# EAGLE design sonopi-digi (EAGLE 9.3.0)
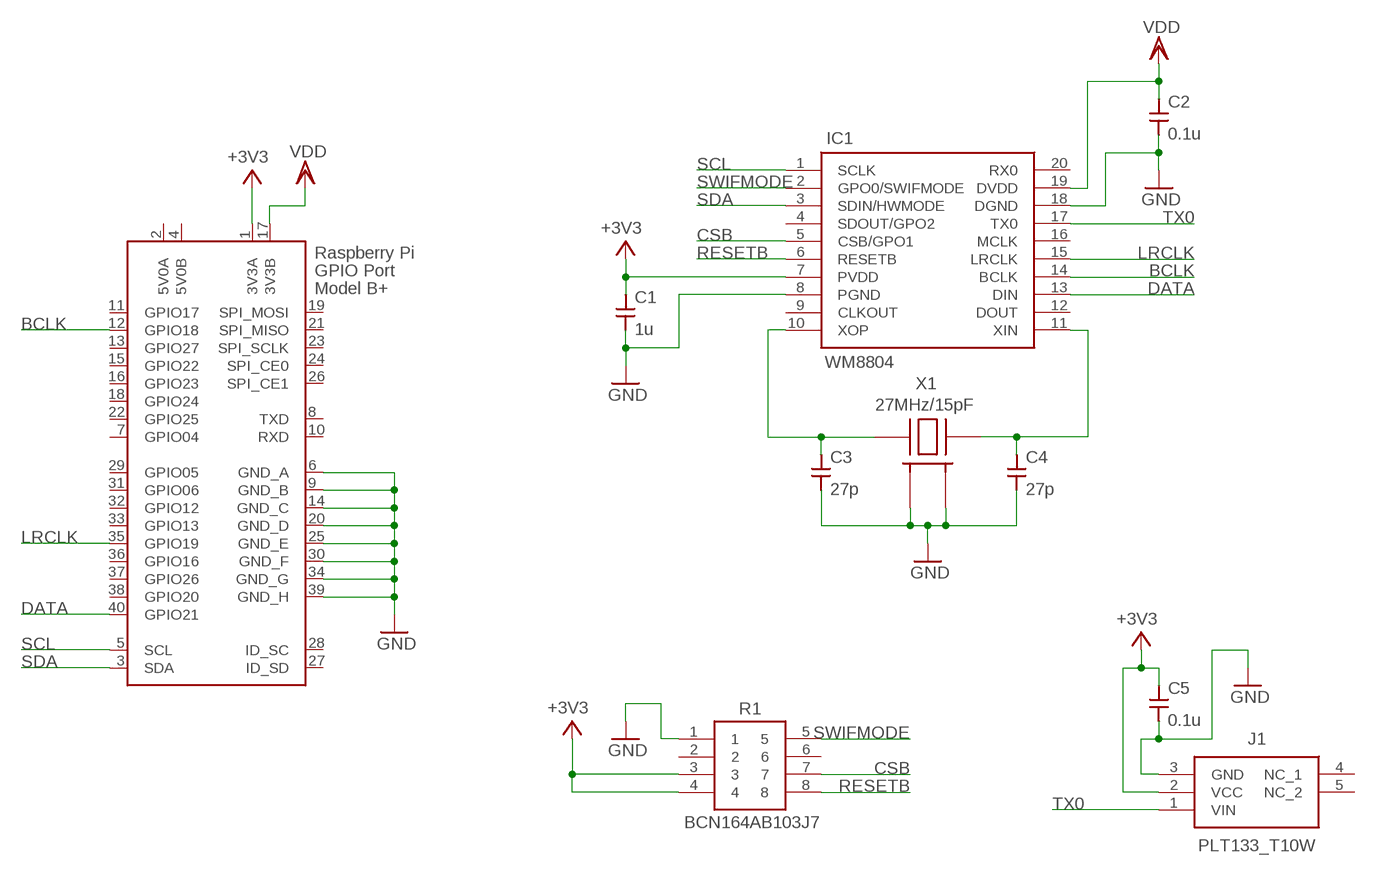
[diagram p0: schematic, sheet 1]

## Parts
C1  1u  CAPACITOR1608  [SMD1608]
C2  0.1u  CAPACITOR1608  [SMD1608]
C3  27p  CAPACITOR1608  [SMD1608]
C4  27p  CAPACITOR1608  [SMD1608]
C5  0.1u  CAPACITOR1608  [SMD1608]
IC1  WM8804  [SOP65P780X200-20N]
J1  PLT133_T10W  [PLT133T10W]
J2  RASPI_BOARD_B+#_SMALL  [RASPI_BOARD_B+HAT_SMALL]
R1  BCN164AB103J7  BCN164A102J7  [BCN164A_1]
X1  27MHz/15pF  CRYSTAL3225HS  [CRYSTAL3225-HS]

## Nets
+3V3: C1.1 C5.1 IC1.7(PVDD) J1.2(VCC) J2.1(3V3A) R1.3 R1.4
BCLK: IC1.14(BCLK) J2.12(GPIO18)
CSB: IC1.5(CSB/GPO1) R1.7
DATA: IC1.13(DIN) J2.40(GPIO21)
GND: C1.2 C2.2 C3.2 C4.2 C5.2 IC1.8(PGND) IC1.18(DGND) J1.3(GND) J2.6(GND_A) J2.9(GND_B) J2.14(GND_C) J2.20(GND_D) J2.25(GND_E) J2.30(GND_F) J2.34(GND_G) J2.39(GND_H) R1.1 X1.2(GND_1) X1.4(GND_2)
LRCLK: IC1.15(LRCLK) J2.35(GPIO19)
RESETB: IC1.6(RESETB) R1.8
SCL: IC1.1(SCLK) J2.5(SCL)
SDA: IC1.3(SDIN/HWMODE) J2.3(SDA)
SWIFMODE: IC1.2(GPO0/SWIFMODE) R1.5
TX0: IC1.17(TX0) J1.1(VIN)
VDD: C2.1 IC1.19(DVDD) J2.17(3V3B)
XIN: C4.1 IC1.11(XIN) X1.3(HOT_2)
XOP: C3.1 IC1.10(XOP) X1.1(HOT_1)
Unconnected: IC1.4(SDOUT/GPO2) IC1.9(CLKOUT) IC1.12(DOUT) IC1.16(MCLK) IC1.20(RX0) J1.4(NC_1) J1.5(NC_2) J2.7(GPIO04) J2.8(TXD) J2.10(RXD) J2.11(GPIO17) J2.13(GPIO27) J2.15(GPIO22) J2.16(GPIO23) J2.18(GPIO24) J2.19(SPI_MOSI) J2.21(SPI_MISO) J2.22(GPIO25) J2.23(SPI_SCLK) J2.24(SPI_CE0) J2.26(SPI_CE1) J2.27(ID_SD) J2.28(ID_SC) J2.29(GPIO05) J2.31(GPIO06) J2.32(GPIO12) J2.33(GPIO13) J2.36(GPIO16) J2.37(GPIO26) J2.38(GPIO20) R1.2 R1.6

## Power pins joined to a net without a drawn wire
5V0A: J2.2(5V0A)
5V0B: J2.4(5V0B)

## Library data of the parts
C1-C5 = gen-discrete2:CAPACITOR: Generic Capacitor
IC1 = WM8804GEDS_RV:WM8804: WOLFSON MICROELECTRONICS - WM8804GEDS/RV - TRANSCEIVER, S/PDIF, 1:1, 20SSOP Source: Datasheet <http://www.cirrus.com/en/pubs/proDatasheet/WM8804_v4.5.pdf>; DESCRIPTION: WOLFSON MICROELECTRONICS - WM8804GEDS/RV - TRANSCEIVER, S/PDIF, 1:1, 20SSOP; HEIGHT: 2mm; MANUFACTURER_NAME: WOLFSON MICROELECTRONICS; MANUFACTURER_PART_NUMBER: WM8804GEDS/RV
J1 = PLT133_T10W:PLT133_T10W: Fiber Optic Transmitters, Receivers, Transceivers Photo Link Source: Datasheet <http://www.everlight.com/file/ProductFile/201407061837400405.pdf>; DESCRIPTION: Fiber Optic Transmitters, Receivers, Transceivers Photo Link; HEIGHT: 10mm; MANUFACTURER_NAME: Everlight; MANUFACTURER_PART_NUMBER: PLT133/T10W; MOUSER_PART_NUMBER: 638-PLT133T10W; MOUSER_PRICE-STOCK: https://www.mouser.com/Search/Refine.aspx?Keyword=638-PLT133T10W; RS_PART_NUMBER: 638-PLT133T10W; RS_PRICE-STOCK: https://www.mouser.com/Search/Refine.aspx?Keyword=638-PLT133T10W
J2 = raspi-zero:RASPI_BOARD_B+#: Raspberry Pi GPIO connector with markings for the outer dimensions of the Raspberry Pi board model B+ with different sets of drill holes or mounting pads All pins connected
R1 = BCN164A102J7:BCN164A102J7: BI TECHNOLOGIES / TT ELECTRONICS - BCN164A102J7 - RESISTOR, RESISTOR ARRAY, 4, 1KOHM, 5%, 1206 Source: Datasheet <http://www.farnell.com/datasheets/2158867.pdf>; ARROW_PART_NUMBER: BCN164A102J7; DESCRIPTION: BI TECHNOLOGIES / TT ELECTRONICS - BCN164A102J7 - RESISTOR, RESISTOR ARRAY, 4, 1KOHM, 5%, 1206; HEIGHT: mm; MANUFACTURER_NAME: BI Technologies; MANUFACTURER_PART_NUMBER: BCN164A102J7
X1 = CRYSTAL3225:CRYSTAL3225: Crystals 3225

## Board
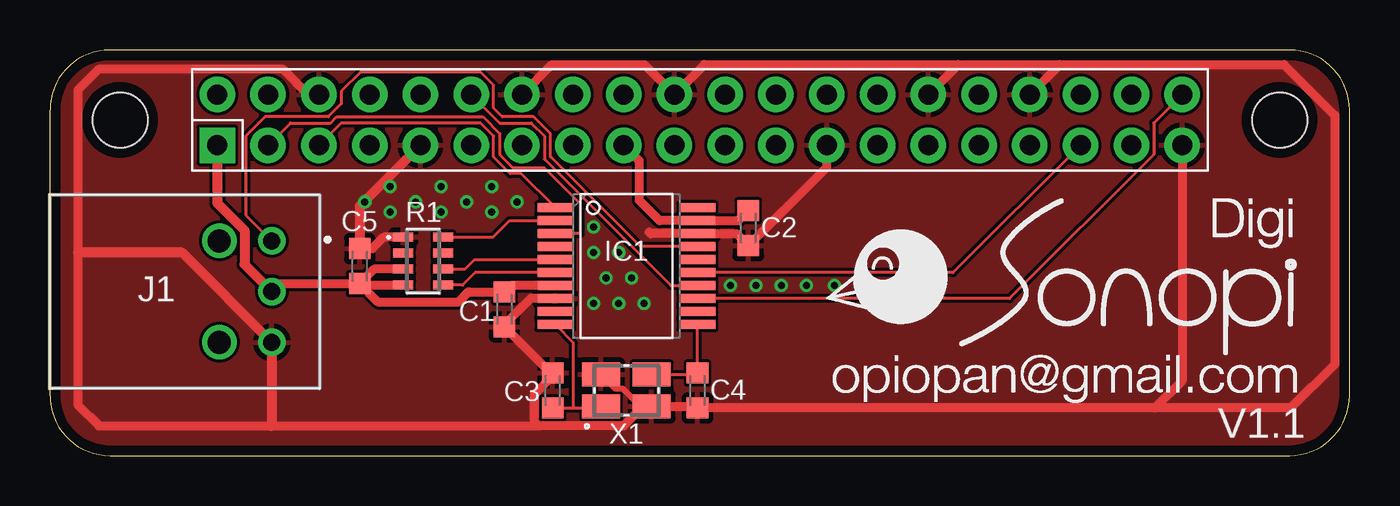
[diagram p1: board, top side]
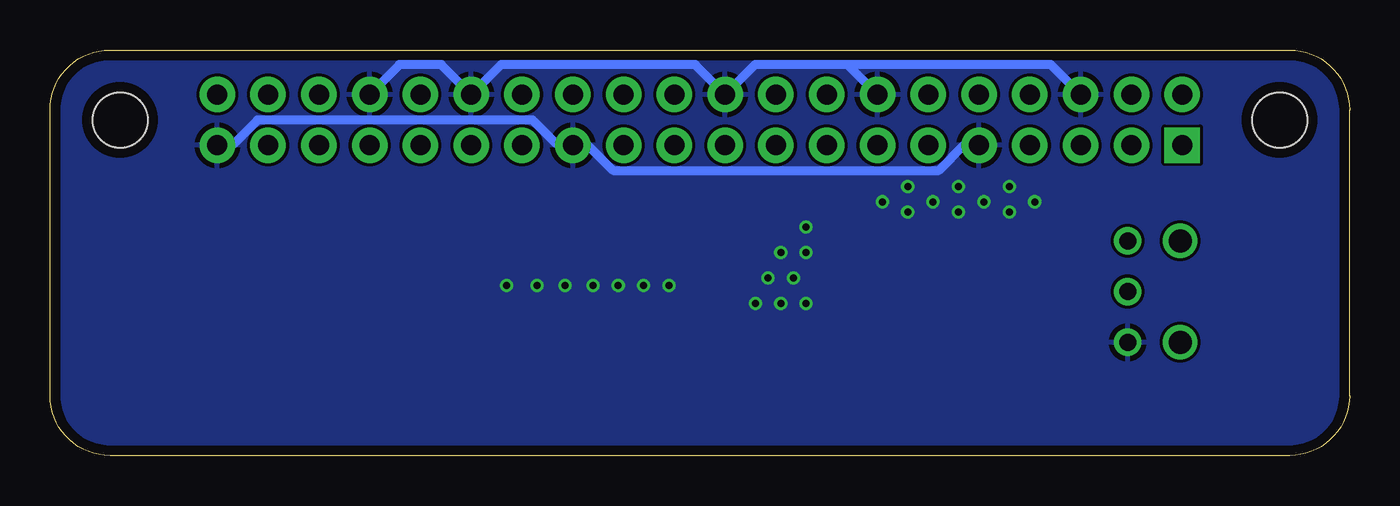
[diagram p2: board, bottom side, seen from below]

Size 65 x 20.3 mm. Coordinates in mm from the lower left corner, seen from the top.
Copper layers (1*16): Top 0.035mm / dielectric 1.6mm / Bottom 0.035mm
Design rules "Elecrow_2-layer_PCB_eagle_rule": minimum track width 6mil, minimum drill 12mil, track to track 6mil, track to pad 6mil, pad to pad 6mil, via to via 8mil, smd to smd 0mil, copper to edge 20mil, drill to drill 10mil, minimum pad ring 6mil, minimum via ring 6mil, stop-mask expansion 0mil, vias tented up to drill 100mil, thermal gap 10mil

### Footprints (pad centres in the part's own frame; a part is rotated, then mirrored left to right if it is on the bottom)
SMD1608 = smd 1.05 x 1.08: 1 -0.875,0; 2 0.875,0
SOP65P780X200-20N = smd 1.8 x 0.45: 1 -3.55,2.925; 2 -3.55,2.275; 3 -3.55,1.625; 4 -3.55,0.975; 5 -3.55,0.325; 6 -3.55,-0.325; 7 -3.55,-0.975; 8 -3.55,-1.625; 9 -3.55,-2.275; 10 -3.55,-2.925; 11 3.55,-2.925; 12 3.55,-2.275; 13 3.55,-1.625; 14 3.55,-0.975; 15 3.55,-0.325; 16 3.55,0.325; 17 3.55,0.975; 18 3.55,1.625; 19 3.55,2.275; 20 3.55,2.925
PLT133T10W = drill 0.85 pad 1.381: 1 2.54,-4.11; 2 0,-4.11; 3 -2.54,-4.11 | drill 1.15 pad 1.725: 4 2.54,-1.48; 5 -2.54,-1.48
RASPI_BOARD_B+HAT_SMALL = drill 1 pad 1.778 square: 1 8.37,15.53 | drill 1 pad 1.778: 2 8.37,18.07; 3 10.91,15.53; 4 10.91,18.07; 5 13.45,15.53; 6 13.45,18.07; 7 15.99,15.53; 8 15.99,18.07; 9 18.53,15.53; 10 18.53,18.07; 11 21.07,15.53; 12 21.07,18.07; 13 23.61,15.53; 14 23.61,18.07; 15 26.15,15.53; 16 26.15,18.07; 17 28.69,15.53; 18 28.69,18.07; 19 31.23,15.53; 20 31.23,18.07; 21 33.77,15.53; 22 33.77,18.07; 23 36.31,15.53; 24 36.31,18.07; 25 38.85,15.53; 26 38.85,18.07; 27 41.39,15.53; 28 41.39,18.07; 29 43.93,15.53; 30 43.93,18.07; 31 46.47,15.53; 32 46.47,18.07; 33 49.01,15.53; 34 49.01,18.07; 35 51.55,15.53; 36 51.55,18.07; 37 54.09,15.53; 38 54.09,18.07; 39 56.63,15.53; 40 56.63,18.07 | hole 2.75: 3.5,16.8; 61.5,16.8
BCN164A_1 = smd 0.45 x 1: 1 -1.2,-1; 2 -0.4,-1; 3 0.4,-1; 4 1.2,-1; 5 -1.2,1; 6 -0.4,1; 7 0.4,1; 8 1.2,1
CRYSTAL3225-HS = smd 1.9 x 1.2: 1 -1.26,-0.8; 2 1.26,-0.8; 3 1.26,0.8; 4 -1.26,0.8

### Placement (x,y rotation side)
C1  22.73,7.32 270 top
C2  34.92,11.38 270 top
C3  25.15,3.25 90 top
C4  32.38,3.25 270 top
C5  15.49,9.48 90 top
IC1  28.83,9.48 0 top
J1  6.99,8.21 90 top
J2  0,0 0 top
R1  18.67,9.73 270 top
U$1  [SONOPI-DIGI-LOGO]  37.97,1.14 0 top
X1  28.83,3.25 0 top

### Tracks (layer width: path | path; a pad name or v marks a point on that pad's centre or on a via)
+3V3
  Top 0.45: J1.2 11.49,8.6 C5.1 | IC1.7 23.04,8.5 C1.1 20.95,8.19 20.45,7.7 16.4,7.7 C5.1 | C5.1 15.56,8.53 R1.4 | R1.3 16.22,9.33 C5.1
  Top 0.5: J2.1 8.37,12.63 9.73,11.27 9.73,9.57 J1.2
BCLK
  Top 0.152: J2.12 22.49,16.65 24.07,16.65 24.73,15.99 24.73,14.83 31.06,8.5 IC1.14
CSB
  Top 0.152: R1.7 20.76,9.33 21.23,9.8 IC1.5
DATA
  Top 0.152: J2.40 55.21,16.65 55.21,15.07 47.99,7.85 IC1.13
GND  (via drill 0.35)
  Top 0.3: X1.4 28.27,3.36 28.64,3.36 29.55,2.45 X1.2
  Top 0.45: IC1.8 24.03,7.85 22.73,6.56 C1.2 25.05,4.13 C3.2 25.15,3.98 24.23,3.06 24.23,1.7 24.45,1.48 | R1.1 16.69,10.93 16.11,10.35 C5.2 | 27.49,4.13 X1.4 | 24.45,1.48 28.68,1.48 29.65,2.45 X1.2 32.31,2.45 C4.2 55.26,2.38 | J2.39 56.63,3.75 55.26,2.38 | J2.6 12.92,18.07 11.65,19.34 2.44,19.34 1.39,18.28 1.39,10.16 1.39,2.54 2.46,1.48 11.05,1.48 24.45,1.48 | J2.34 50.51,19.57 | 50.51,19.57 61.71,19.57 64.27,17.01 64.27,4.57 62.07,2.38 55.26,2.38 | J2.30 45.43,19.57 | 45.43,19.57 50.51,19.57 | 45.43,19.57 32.73,19.57 J2.20 29.74,19.56 25.1,19.56 J2.14 | J2.25 38.85,14.43 C2.2 34.33,11.1 IC1.18 30.05,11.1 29.97,11.18
  Top 0.5: 11.05,1.48 11.1,1.52 J1.3 6.6,10.16 1.39,10.16 | J2.9 15.49,12.49 C5.2
  Bottom 0.45: J2.39 55.82,15.59 54.62,16.8 40.87,16.8 39.66,15.59 J2.25 38.1,15.53 36.84,14.26 20.55,14.26 19.28,15.53 J2.9 | J2.6 14.95,19.57 25.11,19.57 | 25.11,19.57 29.73,19.57 J2.20 32.73,19.57 42.43,19.57 J2.30 45.43,19.57 47.51,19.57 J2.34 | J2.14 25.11,19.57
  other vias: 34.04,8.51 35.31,8.51 36.58,8.51 37.85,8.51 39.24,8.51 40.64,8.51 42.16,8.51 27.18,11.43 27.18,10.16 28.45,10.16 27.81,8.89 27.18,7.62 28.45,7.62 29.08,8.89 29.72,7.62 23.37,12.7 20.83,12.7 22.1,13.46 22.1,12.19 18.29,12.7 19.56,13.46 19.56,12.19 17.02,13.46 17.02,12.19 15.75,12.7
  pour Top: 0,0 0,20.32 55.88,20.32 64.77,20.32 64.77,3.81 64.77,0
  pour Bottom: -1.27,20.32 48.26,20.32 66.04,20.32 66.04,3.81 66.04,0 2.54,0 -1.27,0
LRCLK
  Top 0.152: J2.35 45.17,9.15 IC1.15
RESETB
  Top 0.152: R1.8 20.64,8.53 21.27,9.15 IC1.6
SCL
  Top 0.152: IC1.1 23.57,14.11 23.02,14.11 22.19,14.94 22.19,15.99 21.53,16.65 14.57,16.65 J2.5
SDA
  Top 0.152: IC1.3 26.52,11.1 26.52,12.61 24.72,14.41 23.15,14.41 22.49,15.07 22.49,16.12 21.66,16.95 14.34,16.95 14.04,16.65 12.03,16.65 J2.3
SWIFMODE
  Top 0.152: R1.5 22.16,10.93 22.98,11.75 IC1.2
TX0
  Top 0.152: IC1.17 29.54,10.45 25.03,14.96 25.03,16.12 24.2,16.95 22.62,16.95 22.19,17.38 22.19,18.53 21.53,19.19 15.53,19.19 14.57,18.23 14.57,17.61 13.91,16.95 10.75,16.95 9.79,15.99 9.79,12.05 J1.1
VDD
  Top 0.45: C2.1 34.42,11.75 IC1.19 30.49,11.75 29.46,12.78 29.46,14.76 J2.17
XIN
  Top 0.152: X1.3 32.31,4.05 C4.1 IC1.11
XOP
  Top 0.152: C3.1 26.16,2.38 | 26.16,2.38 27.49,2.38 X1.1 | IC1.10 26.16,5.67 26.16,2.38

### Text on the board
tPlace: V1.1